# Altium schematic sheet ShutdownV2.SchDoc
size A; Organization: Cal Poly Racing; engineer1: who?
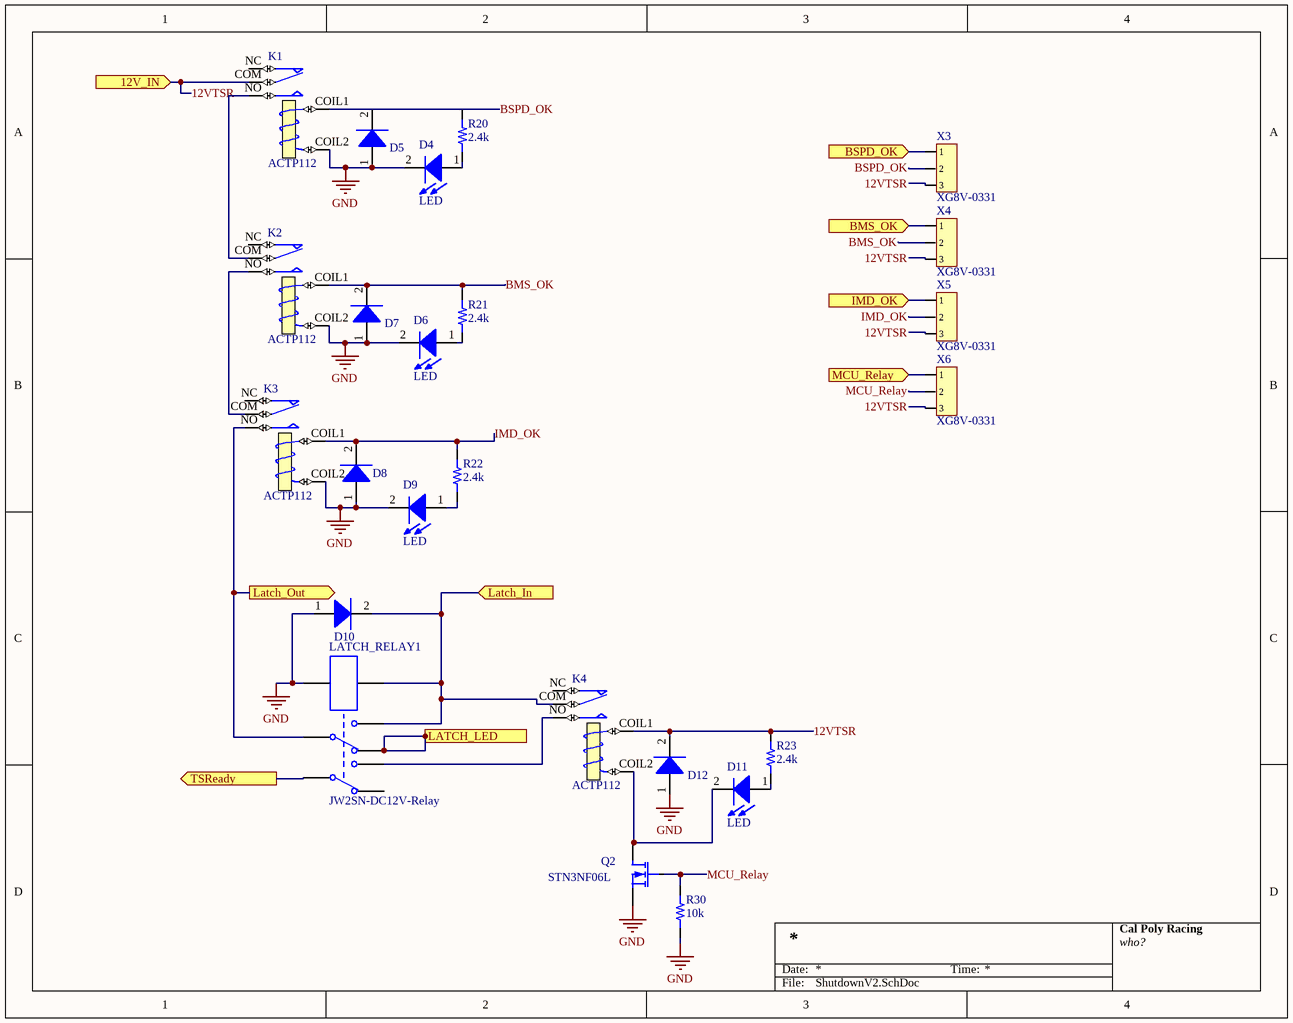
[diagram p0: ShutdownV2.SchDoc]

## Parts
D4  LED  [0805_LED]
D5  *  [SOD123F]  (value not drawn)
D6  LED  [0805_LED]
D7  *  [SOD123F]  (value not drawn)
D8  *  [SOD123F]  (value not drawn)
D9  LED  [0805_LED]
D10  *  [SOD123F]  (value not drawn)
D11  LED  [0805_LED]
D12  *  [SOD123F]  (value not drawn)
K1  ACTP112  [ACTP112]
K2  ACTP112  [ACTP112]
K3  ACTP112  [ACTP112]
K4  ACTP112  [ACTP112]
LATCH_RELAY1  JW2SN-DC12V-Relay  [JW2SN-DC12V-Relay]
Q2  STN3NF06L  [STN3NF06L]
R20  2.4k  [RES 0603/1608]
R21  2.4k  [RES 0603/1608]
R22  2.4k  [RES 0603/1608]
R23  2.4k  [RES 0603/1608]
R30  10k  [RES 0603/1608]
X3  XG8V-0331  [XG8V-0331]
X4  XG8V-0331  [XG8V-0331]
X5  XG8V-0331  [XG8V-0331]
X6  XG8V-0331  [XG8V-0331]

## Ports
12V_IN (in), BMS_OK (in), BSPD_OK (in), IMD_OK (in), Latch_In (in), LATCH_LED (out), Latch_Out (out), MCU_Relay (in), TSReady (out)

## Nets
GND: D4.2(K) D5.1(A) D6.2(K) D7.1(A) D8.1(A) D9.2(K) D10.1(A) D12.1(A) K1.COIL2(T2) K2.COIL2(T2) K3.COIL2(T2) LATCH_RELAY1.1(COIL1) Q2.3(S) R30.1
12VTSR: D12.2(K) K1.COM K4.COIL1(T1) R23.2 X3.3 X4.3 X5.3 X6.3 ; port 12V_IN
BMS_OK: D7.2(K) K2.COIL1(T1) R21.2 X4.2
BMS_OK: X4.1 ; port BMS_OK  [a separate net that carries the same name]
BSPD_OK: D5.2(K) K1.COIL1(T1) R20.2 X3.2
BSPD_OK: X3.1 ; port BSPD_OK  [a separate net that carries the same name]
IMD_OK: D8.2(K) K3.COIL1(T1) R22.2 X5.2
IMD_OK: X5.1 ; port IMD_OK  [a separate net that carries the same name]
Latch_In: D10.2(K) K4.COM LATCH_RELAY1.4(N.O1) LATCH_RELAY1.8(COIL2) ; port Latch_In
LATCH_LED: LATCH_RELAY1.2(N.C1) ; port LATCH_LED
Latch_Out: K3.NO LATCH_RELAY1.3(COM1) ; port Latch_Out
MCU_Relay: X6.1 ; port MCU_Relay
MCU_Relay: Q2.1(G) R30.2 X6.2  [a separate net that carries the same name]
TSReady: LATCH_RELAY1.6(COM2) ; port TSReady
NetD4_1: D4.1(A) R20.1
NetD6_1: D6.1(A) R21.1
NetD9_1: D9.1(A) R22.1
NetD11_1: D11.1(A) R23.1
NetD11_2: D11.2(K) K4.COIL2(T2) Q2.2(D)
NetK1_NO: K1.NO K2.COM
NetK2_NO: K2.NO K3.COM
NetK4_NO: K4.NO LATCH_RELAY1.5(N.O2)

Not connected (* = marked no-connect by the designer): K1 NC; K2 NC; K3 NC; K4 NC; LATCH_RELAY1 7(N.C2)

## Notes on the sheet
- Date:
- Time:
- File:

## Library data of the parts
D4 D6 D9 D11 = 19: Generic 0805 LED; id: 19; vr: 1; name: 0805 LED; numcircuits: 1; package: 0805; quantity: 0
D5 D7 D8 D10 D12 = 2: Diode Super Barrier 40V 1A Surface Mount SOD-; id: 2; name: 1N5819; mfrpartno: *; package: SOD-123; quantity: 0; link: https://www.digikey.com/product-detail/en/diodes-incorporated/1N5819HW1-7-F/1N5819HW1-7-FDITR-ND/5768523
K1-K4 = 1: id: 1; current: 0; voltage: 12; Published: 8-Jun-2000; LatestRevisionDate: 17-Jul-2002; LatestRevisionNote: Re-released for DXP Platform.; PackageReference: MODULE5B; Publisher: Altium Limited; name: ACTP112; quantity: 0; link: https://www.digikey.com/product-detail/en/panasonic-electric-works/ACTP112/255-5163-ND/4691838; createdby: Kevin
LATCH_RELAY1 = 2: Manufacturer_id: 1; idRelay: 2; Name: Relay JW2SN-DC12; Drawer_id: 1
Q2 = 8: MOSFET N-CH 60V 4A SOT223; id: 8; type: N_Channel; vdsmax: 0; numcircuits: 1; rdson: 70m; name: STN3NF06L; current: 4A; vgsmax: 0; package: SOT-233; quantity: 0; link: https://www.digikey.com/product-detail/en/stmicroelectronics/STN3NF06L/497-3177-1-ND/654516
R20-R23 R30 = 1: id: 1; name: 0603 Resistor; percent tolerance: 5; package: 0603; quantity: 0
  R20-R23: resistance: 2.4k
  R30: resistance: 10k
X3-X6 = 8: XG8V-0331_3pin_header; id: 8; numcontacts: 3; pitch: 2.54 mm; quantity: 0; link: https://www.digikey.com/products/en/connectors-interconnects/rectangular-connectors-headers-male-pins/314?k=jumper&k=&pkeyword=jumper&pv88=5&sf=0&FV=ffe0013a&quantity=&ColumnSort=0&page=1&pageSize=25